# Altium project Sismin.PrjPcb
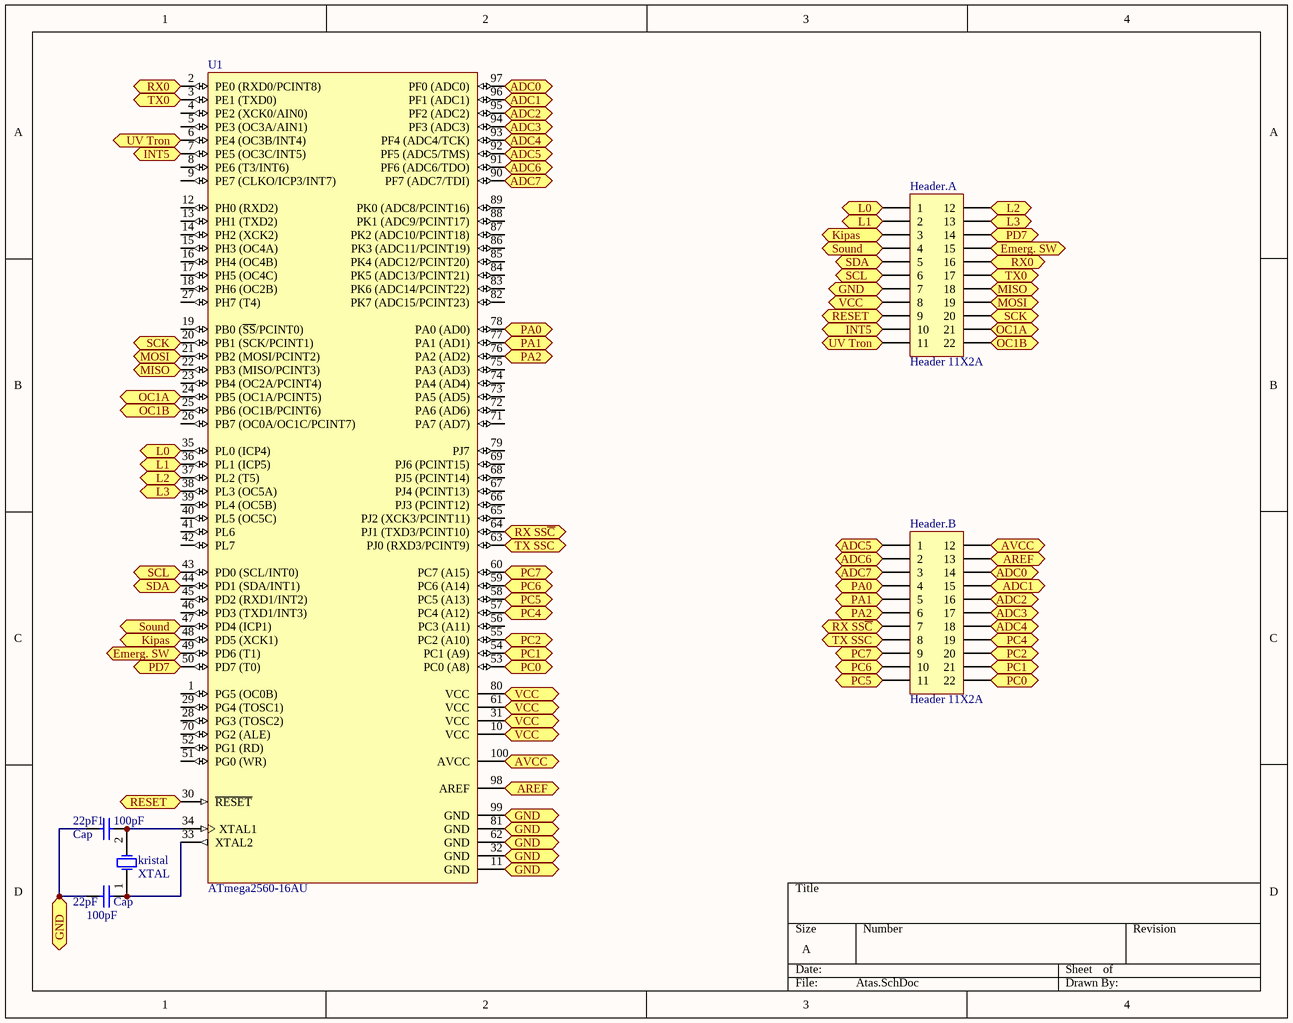
[diagram p0: Atas.SchDoc]
1 sheet, 6 parts. Net scope: flat (ports and power ports of the same name join across sheets).

## Sheet Atas.SchDoc
size A

### Parts
22pF  Cap  value 100pF  [RAD-0.3]
22pF1  Cap  value 100pF  [RAD-0.3]
Header.A  Header 11X2A  [HDR2X11_CEN]
Header.B  Header 11X2A  [HDR2X11_CEN]
kristal  XTAL  [BCY-W2/D3.1]
U1  ATmega2560-16AU  [100A_M]

### Ports
ADC0, ADC1, ADC2, ADC3, ADC4, ADC5, ADC6, ADC7, AREF, AVCC, Emerg. SW, GND, INT5, Kipas, L0, L1, L2, L3, MISO, MOSI, OC1A, OC1B, PA0, PA1, PA2, PC0, PC1, PC2, PC4, PC5, PC6, PC7, PD7, RESET, RX0, RX SS~{C}, SCK, SCL, SDA, Sound, TX0, TX SSC, UV Tron, VCC

### Nets
Net22pF1_2: 22pF1.2 kristal.2(OSC2) U1.34(XTAL1)
Net22pF_1: 22pF.1 22pF1.1 Header.A.7 U1.11(GND) U1.32(GND) U1.62(GND) U1.81(GND) U1.99(GND) ; port GND
Net22pF_2: 22pF.2 kristal.1(OSC1) U1.33(XTAL2)
NetHeader.A_1: Header.A.1 U1.35(PL0_(ICP4)) ; port L0
NetHeader.A_2: Header.A.2 U1.36(PL1_(ICP5)) ; port L1
NetHeader.A_3: Header.A.3 U1.48(PD5_(XCK1)) ; port Kipas
NetHeader.A_4: Header.A.4 U1.47(PD4_(ICP1)) ; port Sound
NetHeader.A_5: Header.A.5 U1.44(PD1_(SDA/INT1)) ; port SDA
NetHeader.A_6: Header.A.6 U1.43(PD0_(SCL/INT0)) ; port SCL
NetHeader.A_8: Header.A.8 U1.10(VCC) U1.31(VCC) U1.61(VCC) U1.80(VCC) ; port VCC
NetHeader.A_9: Header.A.9 U1.30(~{RESET}) ; port RESET
NetHeader.A_10: Header.A.10 U1.7(PE5_(OC3C/INT5)) ; port INT5
NetHeader.A_11: Header.A.11 U1.6(PE4_(OC3B/INT4)) ; port UV Tron
NetHeader.A_12: Header.A.12 U1.37(PL2_(T5)) ; port L2
NetHeader.A_13: Header.A.13 U1.38(PL3_(OC5A)) ; port L3
NetHeader.A_14: Header.A.14 U1.50(PD7_(T0)) ; port PD7
NetHeader.A_15: Header.A.15 U1.49(PD6_(T1)) ; port Emerg. SW
NetHeader.A_16: Header.A.16 U1.2(PE0_(RXD0/PCINT8)) ; port RX0
NetHeader.A_17: Header.A.17 U1.3(PE1_(TXD0)) ; port TX0
NetHeader.A_18: Header.A.18 U1.22(PB3_(MISO/PCINT3)) ; port MISO
NetHeader.A_19: Header.A.19 U1.21(PB2_(MOSI/PCINT2)) ; port MOSI
NetHeader.A_20: Header.A.20 U1.20(PB1_(SCK/PCINT1)) ; port SCK
NetHeader.A_21: Header.A.21 U1.24(PB5_(OC1A/PCINT5)) ; port OC1A
NetHeader.A_22: Header.A.22 U1.25(PB6_(OC1B/PCINT6)) ; port OC1B
NetHeader.B_1: Header.B.1 U1.92(PF5_(ADC5/TMS)) ; port ADC5
NetHeader.B_2: Header.B.2 U1.91(PF6_(ADC6/TDO)) ; port ADC6
NetHeader.B_3: Header.B.3 U1.90(PF7_(ADC7/TDI)) ; port ADC7
NetHeader.B_4: Header.B.4 U1.78(PA0_(AD0)) ; port PA0
NetHeader.B_5: Header.B.5 U1.77(PA1_(AD1)) ; port PA1
NetHeader.B_6: Header.B.6 U1.76(PA2_(AD2)) ; port PA2
NetHeader.B_7: Header.B.7 U1.64(PJ1_(TXD3/PCINT10)) ; port RX SS~{C}
NetHeader.B_8: Header.B.8 U1.63(PJ0_(RXD3/PCINT9)) ; port TX SSC
NetHeader.B_9: Header.B.9 U1.60(PC7_(A15)) ; port PC7
NetHeader.B_10: Header.B.10 U1.59(PC6_(A14)) ; port PC6
NetHeader.B_11: Header.B.11 U1.58(PC5_(A13)) ; port PC5
NetHeader.B_12: Header.B.12 U1.100(AVCC) ; port AVCC
NetHeader.B_13: Header.B.13 U1.98(AREF) ; port AREF
NetHeader.B_14: Header.B.14 U1.97(PF0_(ADC0)) ; port ADC0
NetHeader.B_15: Header.B.15 U1.96(PF1_(ADC1)) ; port ADC1
NetHeader.B_16: Header.B.16 U1.95(PF2_(ADC2)) ; port ADC2
NetHeader.B_17: Header.B.17 U1.94(PF3_(ADC3)) ; port ADC3
NetHeader.B_18: Header.B.18 U1.93(PF4_(ADC4/TCK)) ; port ADC4
NetHeader.B_19: Header.B.19 U1.57(PC4_(A12)) ; port PC4
NetHeader.B_20: Header.B.20 U1.55(PC2_(A10)) ; port PC2
NetHeader.B_21: Header.B.21 U1.54(PC1_(A9)) ; port PC1
NetHeader.B_22: Header.B.22 U1.53(PC0_(A8)) ; port PC0

Not connected (* = marked no-connect by the designer): U1 1(PG5_(OC0B)) 4(PE2_(XCK0/AIN0)) 5(PE3_(OC3A/AIN1)) 8(PE6_(T3/INT6)) 9(PE7_(CLKO/ICP3/INT7)) 12(PH0_(RXD2)) 13(PH1_(TXD2)) 14(PH2_(XCK2)) 15(PH3_(OC4A)) 16(PH4_(OC4B)) 17(PH5_(OC4C)) 18(PH6_(OC2B)) 19(PB0_(~{SS}/PCINT0)) 23(PB4_(OC2A/PCINT4)) 26(PB7_(OC0A/OC1C/PCINT7)) 27(PH7_(T4)) 28(PG3_(TOSC2)) 29(PG4_(TOSC1)) 39(PL4_(OC5B)) 40(PL5_(OC5C)) 41(PL6) 42(PL7) 45(PD2_(RXD1/INT2)) 46(PD3_(TXD1/INT3)) 51(PG0_(WR)) 52(PG1_(RD)) 56(PC3_(A11)) 65(PJ2_(XCK3/PCINT11)) 66(PJ3_(PCINT12)) 67(PJ4_(PCINT13)) 68(PJ5_(PCINT14)) 69(PJ6_(PCINT15)) 70(PG2_(ALE)) 71(PA7_(AD7)) 72(PA6_(AD6)) 73(PA5_(AD5)) 74(PA4_(AD4)) 75(PA3_(AD3)) 79(PJ7) 82(PK7_(ADC15/PCINT23)) 83(PK6_(ADC14/PCINT22)) 84(PK5_(ADC13/PCINT21)) 85(PK4_(ADC12/PCINT20)) 86(PK3_(ADC11/PCINT19)) 87(PK2_(ADC10/PCINT18)) 88(PK1_(ADC9/PCINT17)) 89(PK0_(ADC8/PCINT16))

### Library data of the parts
22pF 22pF1 = Cap: Capacitor; Published: 8-Jun-2000; LatestRevisionDate: 17-Jul-2002; LatestRevisionNote: Re-released for DXP Platform.; PackageReference: RAD-0.3; Publisher: Altium Limited
Header.A Header.B = Header 11X2A: Header, 11-Pin, Dual row; LatestRevisionDate: 17-Jul-2002; LatestRevisionNote: Re-released for DXP Platform.; Publisher: Altium Limited
kristal = XTAL: Crystal Oscillator; Published: 8-Jun-2000; LatestRevisionDate: 17-Jul-2002; LatestRevisionNote: Re-released for DXP Platform.; PackageReference: R38; Publisher: Altium Limited
U1 = ATmega2560-16AU: 8-bit AVR Microcontroller, 4.5-5.5V, 256KB Flash, 4KB EEPROM, 8KB SRAM, 86 GPIO pins, 100-pin TQFP, Industrial Grade (-40°C to 85°C), Pb-Free; Published: 1-Apr-2010; DatasheetVersion: revL, Aug-2007; PackageVersion: revC, Oct-2001; PackageReference: 100A; Publisher: Altium Limited; PackageDescription: 100-Pin Thin Profile Plastic Quad Flat Pack (TQFP), 14 x 14 x 1.0 mm Body, 0.5 mm Pitch; Supplier 1: Digi-Key; Supplier Part Number 1: ATMEGA2560-16AU-ND; Supplier 2: Farnell; Supplier Part Number 2: 1288330; Supplier 3: Farnell; Supplier Part Number 3: 1661740; Supplier 4: Mouser; Supplier Part Number 4: 556-ATMEGA2560-16AU; Code_JEDEC: MS-026-AED; ComponentLink1Description: Manufacturer Link; ComponentLink1URL: http://www.atmel.com/products/avr/default.asp?; ComponentLink2Description: ATmega640/1280/1281/2560/2561 Datasheet; ComponentLink2URL: http://www.atmel.com/dyn/resources/prod_documents/doc2549.pdf; ComponentLink3Description: ATmega640/1280/1281/2560/2561 Summary; ComponentLink3URL: http://www.atmel.com/dyn/resources/prod_documents/2549S.pdf; ComponentLink4Description: Atmel.com Home; ComponentLink4URL: http://www.atmel.com